# Altium schematic sheet DAC schematic.SchDoc
size A; SheetNumber: 8; SheetTotal: 8
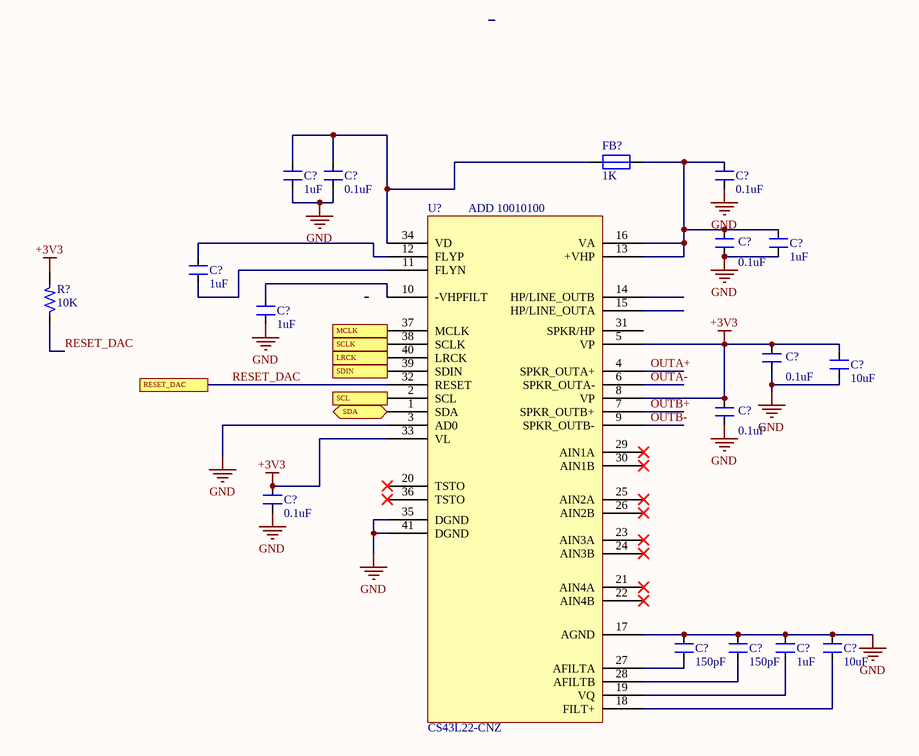
[diagram p0: DAC schematic.SchDoc]

## Parts
(Parts that share a designator on the sheet are numbered #1, #2 ... from top to bottom, then left to right.)
C?#1  1uF  [CAP_0805]
C?#2  0.1uF  [CAP_0805]
C?#3  0.1uF  [CAP_0805]
C?#4  0.1uF  [CAP_0805]
C?#5  1uF  [CAP_0805]
C?#6  1uF  [CAP_0805]
C?#7  1uF  [CAP_0805]
C?#8  0.1uF  [CAP_0805]
C?#9  10uF  [CAP_1206]
C?#10  0.1uF  [CAP_0805]
C?#11  0.1uF  [CAP_0805]
C?#12  150pF  [CAP_0805]
C?#13  150pF  [CAP_0805]
C?#14  1uF  [CAP_0805]
C?#15  10uF  [CAP_1206]
FB?  1K  [IND_0805]
R?  10K  [RES_0603]
U?  CS43L22-CNZ  [QFN40_19_284_33X9_SMD]

## Ports
LRCK, MCLK, RESET_DAC, SCL (in, see ADC Chip[4B]), SCLK, SDA (bidir, see ADC Chip[4B]), SDIN

## Nets
+3V3: C?#8.1 C?#9.2 C?#10.1 C?#11.1 R?.2 U?.5(VP) U?.8(VP) U?.33(VL)
GND: C?#1.2 C?#2.2 C?#3.2 C?#4.2 C?#5.2 C?#7.2 C?#8.2 C?#9.1 C?#10.2 C?#11.2 C?#12.2 C?#13.2 C?#14.2 C?#15.2 U?.3(AD0) U?.17(AGND) U?.35(DGND) U?.41(DGND)
LRCK: U?.40(LRCK) ; port LRCK
MCLK: U?.37(MCLK) ; port MCLK
OUTA+: U?.4(SPKR_OUTA+)
OUTA-: U?.6(SPKR_OUTA-)
OUTB+: U?.7(SPKR_OUTB+)
OUTB-: U?.9(SPKR_OUTB-)
RESET_DAC: R?.1 U?.32(RESET) ; port RESET_DAC
SCL: U?.2(SCL) ; port SCL
SCLK: U?.38(SCLK) ; port SCLK
SDA: U?.1(SDA) ; port SDA
SDIN: U?.39(SDIN) ; port SDIN
NetC?#1_1: C?#1.1 C?#2.1 FB?.1 U?.34(VD)
NetC?#3_1: C?#3.1 C?#4.1 C?#5.1 FB?.2 U?.13(+VHP) U?.16(VA)
NetC?#6_1: C?#6.1 U?.12(FLYP)
NetC?#6_2: C?#6.2 U?.11(FLYN)
NetC?#7_1: C?#7.1 U?.10(-VHPFILT)
NetC?#12_1: C?#12.1 U?.27(AFILTA)
NetC?#13_1: C?#13.1 U?.28(AFILTB)
NetC?#14_1: C?#14.1 U?.19(VQ)
NetC?#15_1: C?#15.1 U?.18(FILT+)

Not connected (* = marked no-connect by the designer): U? 14(HP/LINE_OUTB) 15(HP/LINE_OUTA) 20(TSTO)* 21(AIN4A)* 22(AIN4B)* 23(AIN3A)* 24(AIN3B)* 25(AIN2A)* 26(AIN2B)* 29(AIN1A)* 30(AIN1B)* 31(SPKR/HP) 36(TSTO)*

## Notes on the sheet
- (near U?) ADD 10010100

## Library data of the parts
C?#1 C?#5-C?#7 C?#14 = CAP_1uF-50V-5%-0805: 1µF ±5% 50V Ceramic Capacitor X7R 0805 (2012 Metric); Manufacturer: Samsung; Manufacturer Part Number: CC0805JKX7R9BB105; Alternate Part Number-1: 0805F105M500NT; Case/Package: 0805; Supplier-1: SIRICOM; Supplier Part Number-1: CL21B105KBFNNNE
C?#2-C?#4 C?#8 C?#10 C?#11 = CAP_0.1uF-50V-10%-0805: 0.1µF ±10% 50V Ceramic Capacitor X7R 0805 (2012 Metric); Manufacturer: Samsung; Manufacturer Part Number: CL21B104KBCNNNC; Alternate Part Number-1: NA; Case/Package: 0805; Supplier-1: SIRICOM; Supplier Part Number-1: 0805B104K500CT
C?#9 C?#15 = CAP_10uF-50V-10%-1206: 10µF ±10% 50V Ceramic Capacitor X7R 1206 (3216 Metric); Manufacturer: KEMET; Manufacturer Part Number: CL31B106KBHNNNE; Alternate Part Number-1: GRT31CR61H106ME01L; Case/Package: 1206; Supplier-1: SIRICOM; Supplier Part Number-1: CC1206KKX5R9BB106
C?#12 C?#13 = CAP_150pF-50V-10%-0805: 150pF ±10% 50V Ceramic Capacitor C0G, NP0 0805 (2012 Metric); Manufacturer: AVX Corporation; Manufacturer Part Number: 08055A151KAT2A; Alternate Part Number-1: NA; Case/Package: 0805; Supplier-1: Digikey; Supplier Part Number-1: 478-10501-1-ND - Cut Tape (CT)
FB? = FB_1K-100MHZ-1.6A-0805: 1 kOhms @ 100MHz 1 Power Line Ferrite Bead 0805 (2012 Metric) 1.6A; Manufacturer: Laird; Manufacturer Part Number: BLM21SP102SH1D; Alternate Part Number-1: NA; Case/Package: 0805; Supplier-1: SIRICOM; Supplier Part Number-1: ACMS201209A102
R? = RES_10K-0.1W-1%-0603: 10 kOhms ±1% 0.1W, 1/10W Chip Resistor 0603 (1608 Metric) Automotive AEC-Q200 Thick Film; Manufacturer: Walsin; Manufacturer Part Number: WR06X1002FTL; Alternate Part Number-1: 0603WAJ0103T5E; Case/Package: 0603; Supplier-1: SIRICOM; Supplier Part Number-1: WR06X1002FTL
U? = IC_CS43L22: Audio D/A Converter ICs Low Power Stereo DAC w/ClassD Spkr Driver; Manufacturer: Cirrus Logic; Alternate Part Number-1: NA; Manufacturer Part Number: CS43L22-CNZ; Case/Package: QFN-40; Supplier-1: Mouser; Supplier Part Number-1: 777-CS43L22-CNZ